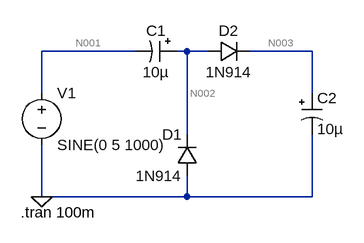
[diagram p0: schematic Draft4.asc]
Draft4.asc, the LTspice schematic file:
Version 4
SHEET 1 880 680
WIRE 48 128 -96 128
WIRE 128 128 112 128
WIRE 160 128 128 128
WIRE 320 128 224 128
WIRE -96 192 -96 128
WIRE 320 192 320 128
WIRE 128 256 128 128
WIRE -96 352 -96 272
WIRE 128 352 128 320
WIRE 128 352 -96 352
WIRE 320 352 320 256
WIRE 320 352 128 352
FLAG -96 352 0
SYMBOL polcap 304 192 R0
SYMATTR InstName C2
SYMATTR Value 10µ
SYMBOL polcap 112 112 R90
WINDOW 0 0 32 VBottom 2
WINDOW 3 32 32 VTop 2
SYMATTR InstName C1
SYMATTR Value 10µ
SYMBOL voltage -96 176 R0
WINDOW 123 0 0 Left 0
WINDOW 39 0 0 Left 0
SYMATTR InstName V1
SYMATTR Value SINE(0 5 1000)
SYMBOL diode 160 144 R270
WINDOW 0 32 32 VTop 2
WINDOW 3 0 32 VBottom 2
SYMATTR InstName D2
SYMATTR Value 1N914
SYMBOL diode 144 320 R180
WINDOW 0 24 64 Left 2
WINDOW 3 24 0 Left 2
SYMATTR InstName D1
SYMATTR Value 1N914
TEXT -128 376 Left 2 !.tran 100m

The netlist it stands for:
* Draft4.asc
C2 N003 0 10µ
C1 N002 N001 10µ
V1 N001 0 SINE(0 5 1000)
D2 N002 N003 1N914
D1 0 N002 1N914
.model D D
.lib standard.dio
.tran 100m
.backanno
.end

* Results of the author's LTspice run, read from the files saved beside the schematic
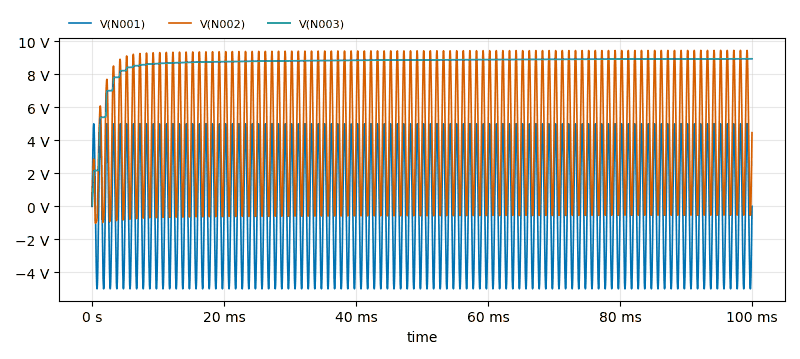
[diagram p1: Transient Analysis of Draft4.asc, plotted from the saved traces]
* Transient Analysis, 1 run:
*   V(N001): min -5 V, max 5 V, average -2.021 mV, rms 3.587 V, last 0 V
*   V(N002): min -1.022 V, max 9.446 V, average 4.33 V, rms 5.597 V, last 4.46 V
*   V(N003): min 0 V, max 8.937 V, average 8.695 V, rms 8.734 V, last 8.937 V